# Altium project Control.PrjPcb
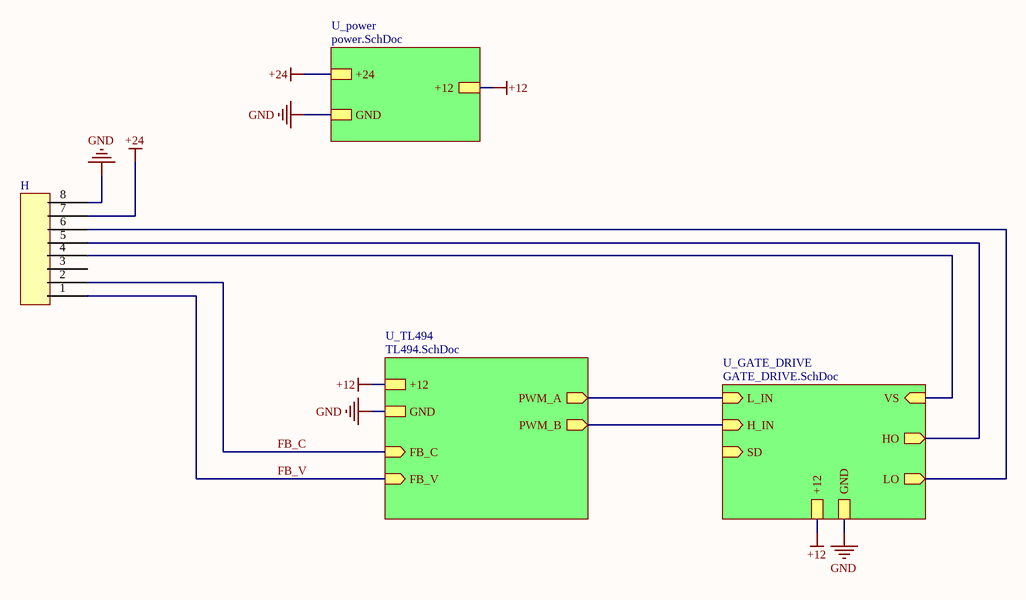
[diagram p0: Control.SchDoc]
4 sheets, 43 parts. Net scope: hierarchical (ports join the sheet entries above them; power ports are global).
Board file: Control.PcbDoc
Sheets:
  Control.SchDoc
    U_GATE_DRIVE = GATE_DRIVE.SchDoc
    U_power = power.SchDoc
    U_TL494 = TL494.SchDoc

## Sheet Control.SchDoc
size A

### Parts
H  pin_header_8pin  [pin_header8]  (value not drawn)

### Sub-sheets
U_GATE_DRIVE = GATE_DRIVE.SchDoc: GND, +12, VS (in), L_IN (in), SD (in), HO (out), LO (out), H_IN (in)
U_power = power.SchDoc: GND, +24, +12
U_TL494 = TL494.SchDoc: GND, +12, PWM_A (out), PWM_B (out), FB_V (in), FB_C (in)

### Nets
+12: sheet U_GATE_DRIVE/+12, sheet U_power/+12, sheet U_TL494/+12
+24: H.7 ; sheet U_power/+24
GND: H.8 ; sheet U_GATE_DRIVE/GND, sheet U_power/GND, sheet U_TL494/GND
FB_C: H.2 ; sheet U_TL494/FB_C
FB_V: H.1 ; sheet U_TL494/FB_V
H_IN: sheet U_GATE_DRIVE/H_IN, sheet U_TL494/PWM_B
HO: H.5 ; sheet U_GATE_DRIVE/HO
L_IN: sheet U_GATE_DRIVE/L_IN, sheet U_TL494/PWM_A
LO: H.6 ; sheet U_GATE_DRIVE/LO
VS: H.4 ; sheet U_GATE_DRIVE/VS

Not connected (* = marked no-connect by the designer): H 3

## Sheet GATE_DRIVE.SchDoc
size A
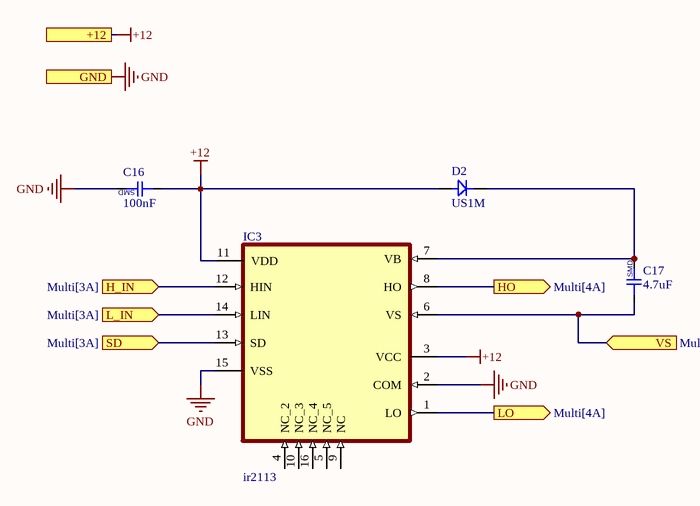
[diagram p1: GATE_DRIVE.SchDoc]

### Parts
C16  100nF  [CAP-0805]
C17  4.7uF  [CAP-0805]
D2  US1M  [DIOD/1N4007/SMD]
IC3  ir2113  [ir2113]

### Ports
+12, GND, H_IN (in, see Multi[3A]), HO (out, see Multi[4A]), L_IN (in, see Multi[3A]), LO (out, see Multi[4A]), SD (in, see Multi[3A]), VS (in, see Multi[4A])

### Nets
+12: C16.1 D2.A IC3.3(VCC) IC3.11(VDD) ; port +12
GND: C16.2 IC3.2(COM) IC3.15(VSS) ; port GND
H_IN: IC3.12(HIN) ; port H_IN
HO: IC3.8(HO) ; port HO
L_IN: IC3.14(LIN) ; port L_IN
LO: IC3.1(LO) ; port LO
SD: IC3.13(SD) ; port SD
VS: C17.1 IC3.6(VS) ; port VS
NetC17_2: C17.2 D2.K IC3.7(VB)

Not connected (* = marked no-connect by the designer): IC3 4(NC_2) 5(NC_5) 9(NC) 10(NC_3) 16(NC_4)

### Notes on the sheet
- (in symbol cap_smd) SMD

### Library data of the parts
C16 C17 = cap_smd
D2 = DIOD/RECTIFIERS

## Sheet power.SchDoc
size 381 x 241 mm
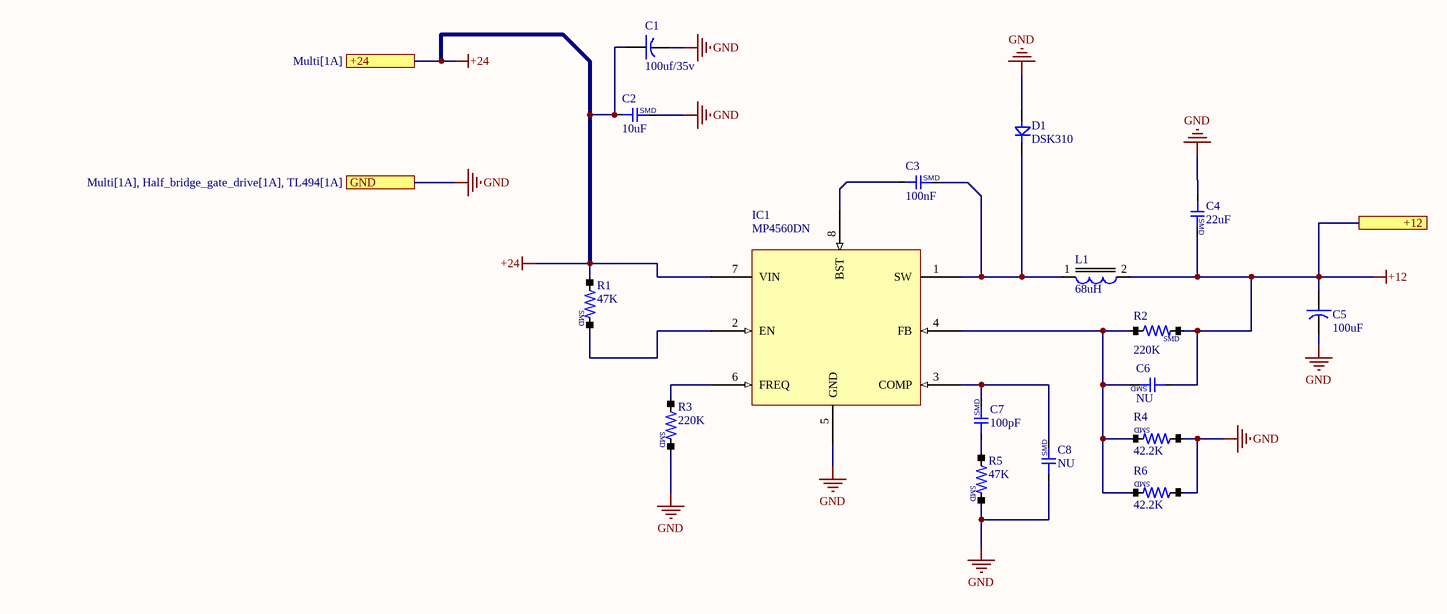
[diagram p2: power.SchDoc]

### Parts
C1  100uf/35v  [cap/330u/16v]
C2  10uF  [CAP-1206]
C3  100nF  [CAP-0603]
C4  22uF  [CAP-1206]
C5  100uF  [cap/330u/16v]
C6  NU  [CAP-0603]
C7  100pF  [CAP-0603]
C8  NU  [CAP-0603]
D1  DSK310  [DIOD/1N4007/SMD]
IC1  MP4560DN  [SOP8_HIT]
L1  68uH  [NR6028T680]
R1  47K  [RES/0603]
R2  220K  [RES/0603]
R3  220K  [RES/0603]
R4  42.2K  [RES/0603]
R5  47K  [RES/0603]
R6  42.2K  [RES/0603]

### Ports
+12, +24 (see Multi[1A]), GND (see Multi[1A], Half_bridge_gate_drive[1A], TL494[1A])

### Nets
+12: C4.2 C5.+ C6.1 L1.2 R2.2 ; port +12
+24: C1.+ C2.1 IC1.7(VIN) R1.1 ; port +24
GND: C1.- C2.2 C4.1 C5.- C8.1 D1.A IC1.5(GND) R3.2 R4.1 R5.2 R6.1 ; port GND
NetC3_1: C3.1 IC1.8(BST)
NetC3_2: C3.2 D1.K IC1.1(SW) L1.1
NetC6_2: C6.2 IC1.4(FB) R2.1 R4.2 R6.2
NetC7_1: C7.1 R5.1
NetC7_2: C7.2 C8.2 IC1.3(COMP)
NetIC1_2: IC1.2(EN) R1.2
NetIC1_6: IC1.6(FREQ) R3.1

### Notes on the sheet
- (in symbol cap_smd) SMD
- (in symbol RES/SMD) SMD

### Library data of the parts
C1 C5 = cap-electrolit
C2-C4 C6-C8 = cap_smd
D1 = DIOD/RECTIFIERS
L1 = inductor
R1-R6 = RES/SMD

## Sheet TL494.SchDoc
size 381 x 241 mm
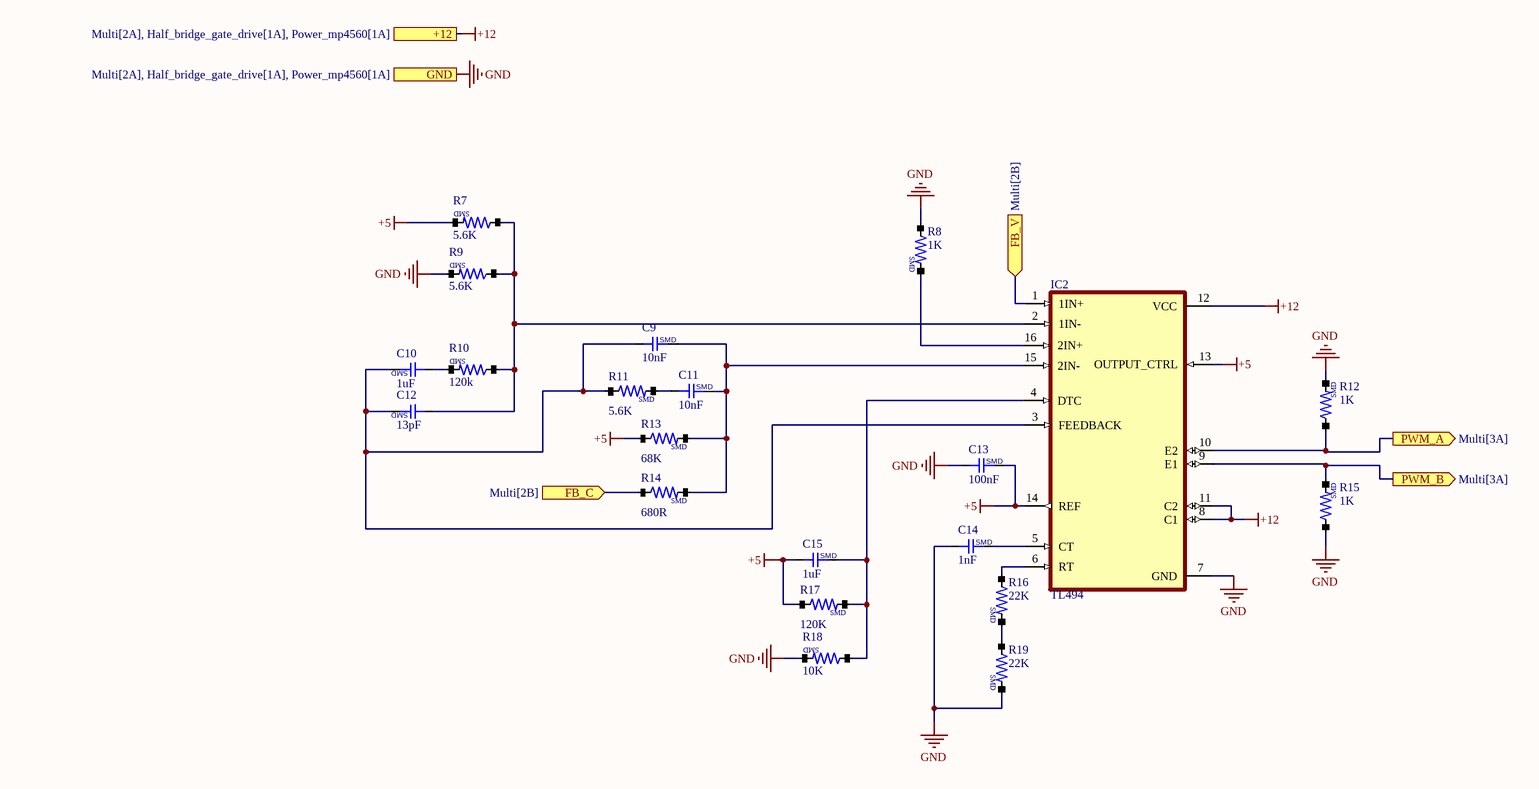
[diagram p3: TL494.SchDoc]

### Parts
C9  10nF  [CAP-0603]
C10  1uF  [CAP-0603]
C11  10nF  [CAP-0603]
C12  13pF  [CAP-0603]
C13  100nF  [CAP-0603]
C14  1nF  [CAP-0603]
C15  1uF  [CAP-0805]
IC2  TL494  [TL494_SMD]
R7  5.6K  [RES/0603]
R8  1K  [RES/0603]
R9  5.6K  [RES/0603]
R10  120k  [RES/0603]
R11  5.6K  [RES/0603]
R12  1K  [RES/0603]
R13  68K  [RES/0603]
R14  680R  [RES/0603]
R15  1K  [RES/0603]
R16  22K  [RES/0603]
R17  120K  [RES/0603]
R18  10K  [RES/0603]
R19  22K  [RES/0603]

### Ports
+12 (see Multi[2A], Half_bridge_gate_drive[1A], Power_mp4560[1A]), FB_C (in, see Multi[2B]), FB_V (in, see Multi[2B]), GND (see Multi[2A], Half_bridge_gate_drive[1A], Power_mp4560[1A]), PWM_A (out, see Multi[3A]), PWM_B (out, see Multi[3A])

### Nets
+5: C13.2 C15.1 IC2.13(OUTPUT_CTRL) IC2.14(REF) R7.2 R13.1 R17.1
+12: IC2.8(C1) IC2.11(C2) IC2.12(VCC) ; port +12
GND: C13.1 C14.1 IC2.7(GND) R8.1 R9.2 R12.2 R15.1 R18.2 R19.2 ; port GND
FB_C: R14.1 ; port FB_C
FB_V: IC2.1(1IN+) ; port FB_V
H_IN: IC2.9(E1) R15.2 ; port PWM_B
L_IN: IC2.10(E2) R12.1 ; port PWM_A
NetC9_1: C9.1 C10.2 C12.2 IC2.3(FEEDBACK) R11.1
NetC9_2: C9.2 C11.2 IC2.15(2IN-) R13.2 R14.2
NetC10_1: C10.1 R10.2
NetC11_1: C11.1 R11.2
NetC12_1: C12.1 IC2.2(1IN-) R7.1 R9.1 R10.1
NetC14_2: C14.2 IC2.5(CT)
NetC15_2: C15.2 IC2.4(DTC) R17.2 R18.1
NetIC2_6: IC2.6(RT) R16.1
NetIC2_16: IC2.16(2IN+) R8.2
NetR16_2: R16.2 R19.1

### Notes on the sheet
- (in symbol cap_smd) SMD
- (in symbol RES/SMD) SMD

### Library data of the parts
C9-C15 = cap_smd
R7-R19 = RES/SMD

## Nets that join several sheets
+12: GATE_DRIVE (C16.1 D2.A IC3.3 IC3.11), power (5 pins), TL494 (IC2.8 IC2.11 IC2.12)
+24: Control (H.7), power (C1.+ C2.1 IC1.7 R1.1)
GND: Control (H.8), GATE_DRIVE (C16.2 IC3.2 IC3.15), power (11 pins), TL494 (9 pins)
FB_C: Control (H.2), TL494 (R14.1)
FB_V: Control (H.1), TL494 (IC2.1)
H_IN: GATE_DRIVE (IC3.12), TL494 (IC2.9 R15.2)
HO: Control (H.5), GATE_DRIVE (IC3.8)
L_IN: GATE_DRIVE (IC3.14), TL494 (IC2.10 R12.1)
LO: Control (H.6), GATE_DRIVE (IC3.1)
VS: Control (H.4), GATE_DRIVE (C17.1 IC3.6)